# Altium schematic sheet Sheet4.SchDoc
size A3; SheetNumber: 4; SheetTotal: 6
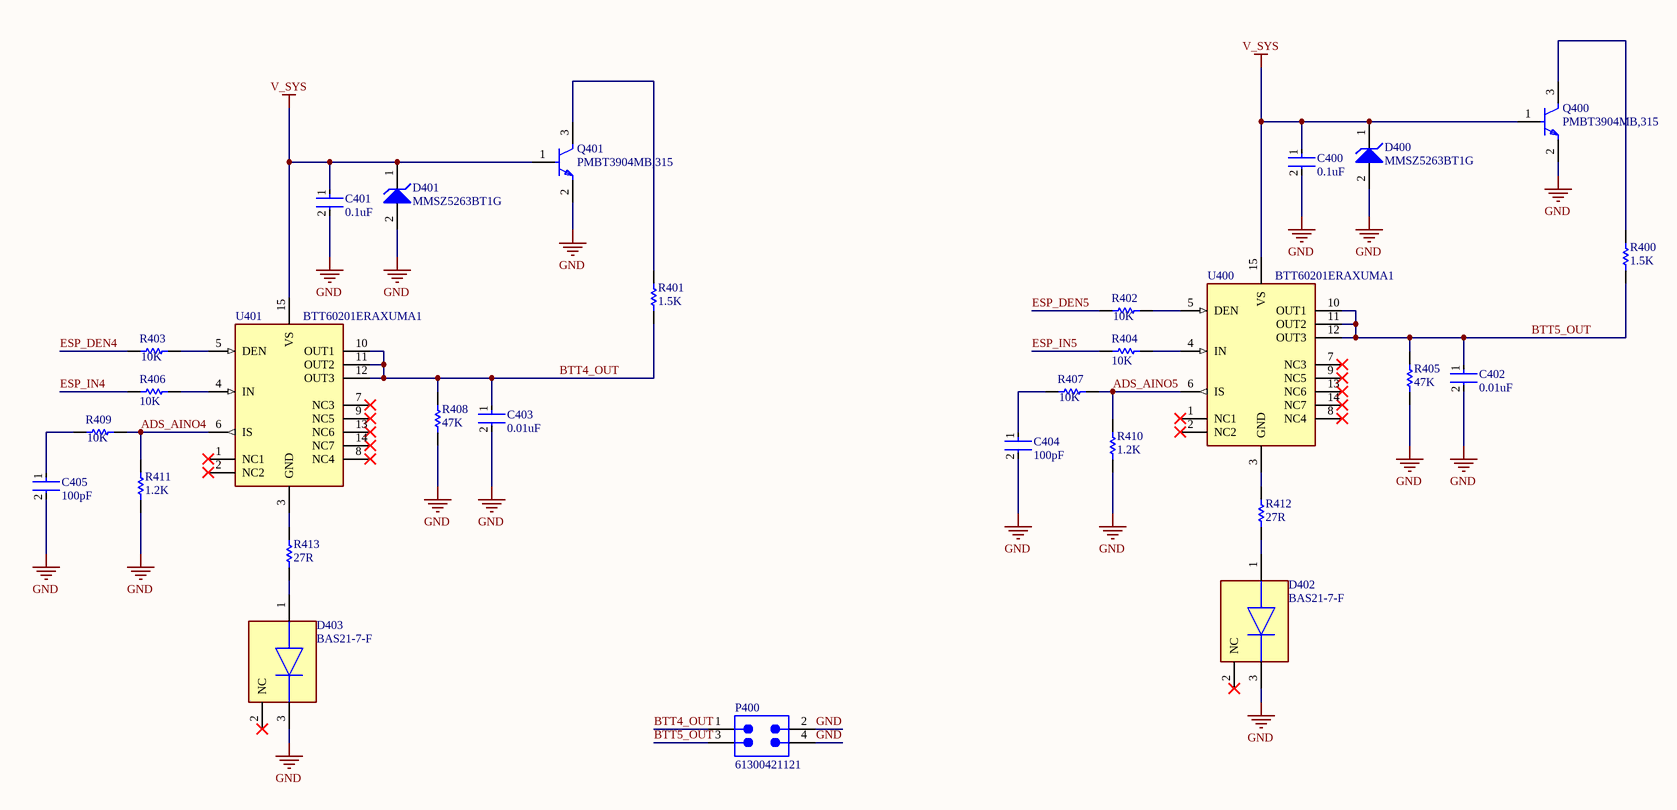
[diagram p0: Sheet4.SchDoc]

## Parts
C400  0.1uF  [FP-GRM155-0_05-IPC_B]
C401  0.1uF  [FP-GRM155-0_05-IPC_B]
C402  0.01uF  [FP-GRM155-0_05-IPC_C]
C403  0.01uF  [FP-GRM155-0_05-IPC_C]
C404  100pF  [FP-C0402-BB-MFG]
C405  100pF  [FP-C0402-BB-MFG]
D400  MMSZ5263BT1G  [ONSC-SOD-123-2-425-04_V]
D401  MMSZ5263BT1G  [ONSC-SOD-123-2-425-04_V]
D402  BAS21-7-F  [FP-SOT23-MFG]
D403  BAS21-7-F  [FP-SOT23-MFG]
P400  61300421121  [61300421121]
Q400  PMBT3904MB,315  [FP-SOT883B-MFG]
Q401  PMBT3904MB,315  [FP-SOT883B-MFG]
R400  1.5K  [RESC1005X40X25ML05T10]
R401  1.5K  [RESC1005X40X25ML05T10]
R402  10K  [RESC1005X40X25LL05T10]
R403  10K  [RESC1005X40X25LL05T10]
R404  10K  [RESC1005X40X25LL05T10]
R405  47K  [RESC1005X40X25ML05T10]
R406  10K  [RESC1005X40X25LL05T10]
R407  10K  [RESC1005X40X25LL05T10]
R408  47K  [RESC1005X40X25ML05T10]
R409  10K  [RESC1005X40X25LL05T10]
R410  1.2K  [RESC1005X40X25ML05T10]
R411  1.2K  [RESC1005X40X25ML05T10]
R412  27R  [RESC1005X40X25LL05T10]
R413  27R  [RESC1005X40X25LL05T10]
U400  BTT60201ERAXUMA1  [BTT60201ERAXUMA1]
U401  BTT60201ERAXUMA1  [BTT60201ERAXUMA1]

## Nets
GND: C400.2 C401.2 C402.2 C403.2 C404.2 C405.2 D400.2(A) D401.2(A) D402.3(C) D403.3(C) P400.2 P400.4 Q400.2(E) Q401.2(E) R405.1 R408.1 R410.1 R411.1
V_SYS: C400.1 C401.1 D400.1(K) D401.1(K) Q400.1(B) Q401.1(B) U400.15(VS) U401.15(VS)
ADS_AINO4: R409.2 R411.2 U401.6(IS)
ADS_AINO5: R407.2 R410.2 U400.6(IS)
BTT4_OUT: C403.1 P400.1 R401.1 R408.2 U401.10(OUT1) U401.11(OUT2) U401.12(OUT3)
BTT5_OUT: C402.1 P400.3 R400.1 R405.2 U400.10(OUT1) U400.11(OUT2) U400.12(OUT3)
ESP_DEN4: R403.1
ESP_DEN5: R402.1
ESP_IN4: R406.1
ESP_IN5: R404.1
NetC404_1: C404.1 R407.1
NetC405_1: C405.1 R409.1
NetD402_1: D402.1(A) R412.1
NetD403_1: D403.1(A) R413.1
NetQ400_3: Q400.3(C) R400.2
NetQ401_3: Q401.3(C) R401.2
NetR402_2: R402.2 U400.5(DEN)
NetR403_2: R403.2 U401.5(DEN)
NetR404_2: R404.2 U400.4(IN)
NetR406_2: R406.2 U401.4(IN)
NetR412_2: R412.2 U400.3(GND)
NetR413_2: R413.2 U401.3(GND)

Not connected (* = marked no-connect by the designer): D402 2(NC)*; D403 2(NC)*; U400 1(NC1)* 2(NC2)* 7(NC3)* 8(NC4)* 9(NC5)* 13(NC6)* 14(NC7)*; U401 1(NC1)* 2(NC2)* 7(NC3)* 8(NC4)* 9(NC5)* 13(NC6)* 14(NC7)*

## Library data of the parts
C400 C401 = CMP-2008-04639-2: Chip Multilayer Ceramic Capacitors for General Purpose, 0402, 0.10uF, X7R, 15%, 10%, 50V; Dissipation Factor: 0.025%; Capacitance: 100nF; Weight: 0.000212oz; Thickness: 0.022inch; Voltage Rating (DC): 50V; Dielectric Material: Ceramic; Termination: SMD/SMT; Case/Package: 0402; Case Code (Imperial): 0402; Mount: Surface Mount; REACH SVHC: No SVHC; Resistor Type: Ceramic; Dielectric: X7R; Max Operating Temperature: 125°C; Voltage: 50V; Lead Free: Lead Free; Package Quantity: 10000; Packaging: Tape and Reel; Length: 1mm; Material: Ceramic; Height: 0.5mm; Depth: 0.5mm; Width: 0.5mm; Min Operating Temperature: -55°C; Tolerance: 10%; Case Code (Metric): 1005; Voltage Rating: 50V
C402 C403 = CMP-2008-04637-5: Chip Multilayer Ceramic Capacitors for General Purpose, 0402, 10000pF, X7R, 15%, 10%, 50V; Voltage: 25V; Capacitance: 10nF; Tolerance: 10%; Mount: Surface Mount; Lead Free: Lead Free; Radiation Hardening: No; Case Code (Imperial): 0402; REACH SVHC: No SVHC; Case/Package: 0402; Dielectric: X7R; Voltage Rating (DC): 50V; Max Operating Temperature: 125°C; Termination: SMD/SMT; Material: Ceramic; Width: 0.02inch; Package Quantity: 1; Voltage Rating: 50V; Thickness: 0.022inch; Packaging: Tape and Reel; Height: 0.5mm; Number of Pins: 2; Case Code (Metric): 1005; Min Operating Temperature: -55°C; Length: 1mm; Depth: 0.5mm
C404 C405 = CMP-2008-03284-2: CAP CER 100PF 50V C0G/NP0 0402; Manufacturer: Kemet; Manufacturer Part Number: C0402C101J5GACTU; Tolerance: 0.05; Temperature Characteristic: C0G; Temperature Coefficient: 15%; Material: Ceramic; Digikey Description: CAP CER 100PF 50V C0G/NP0 0402; Lead Free: Yes; Capacitance: 100 pF; Device Class L3: Ceramic Capacitors; Mouser Description: Multilayer Ceramic Capacitors MLCC - SMD/SMT 50volts 100pF C0G 5%; Octopart: https://octopart.com/c0402c101j5gactu-kemet-132471; Temperature Range Low: -55°C; Value: 100 pF; Automotive: No; Height: 0.55mm; Category: Cap; ComponentLink2URL: https://content.kemet.com/datasheets/KEM_C1002_X7R_SMD.pdf; RoHS: TRUE; Ipc Land Pattern Name: CAPC10050X50; Temperature Range High: +125°C; Device Class L2: Capacitors; Package: C0402-BB; ComponentLink2Description: Datasheet; Temperature: -55°C to +125°C; Voltage Rating: 50 V; Device Class L1: Passive Components
D400 D401 = CMP-1060-00377-1: Zener Voltage Regulator, 500 mW, 2-Pin SOD-123, Pb-Free, Tape and Reel; Manufacturer: On Semiconductor; VZ Typ (V): 56; P Max (W): 0.5; DatasheetVersion: Rev. 12; PackageReference: SOD-123-2-425-04; Mounting Technology: Surface Mount; ComponentLink3URL: http://www.onsemi.com/pub_link/Collateral/425-04.PDF; ComponentLink1Description: Manufacturer URL; ComponentLink3Description: Package Specification; PartNumber: MMSZ5263BT1G; PackageDescription: 2-Pin SOD, Body 1.6 x 2.69 mm; Packing: Tape and Reel; ComponentLink1URL: http://www.onsemi.com/; RoHS: Pb-Free; ComponentLink2Description: Datasheet; ComponentLink2URL: http://www.onsemi.com/pub_link/Collateral/MMSZ5221BT1-D.PDF; PackageVersion: Rev. G, 10/2009
D402 D403 = CMP-12791-000036-1: DIODE GEN PURP 200V 200MA SOT23; Manufacturer: Diodes Inc.; Max Repetitive Reverse Voltage: 250V; Forward Current: 400mA; Max Surge Forward Current: 0.5A; Standoff Height: 0.013mm; Capacitance: 5pF; Max Junction Temp: +150°C; Peak Reverse Current: 0.1uA; Value: 5pF; Device Class L1: Discrete Semiconductors; Category: Diode; Mouser Description: Diodes - General Purpose, Power, Switching 200V 350mW; Digikey Description: DIODE GEN PURP 200V 200MA SOT23; Manufacturer Part Number: BAS21-7-F; Device Class L2: Diodes; RoHS: TRUE; Device Class L3: Rectifier Diodes; Lead Free: Yes; Temperature Range High: +150°C; Ipc Land Pattern Name: SOT92P240X102-3; ComponentLink2Description: Datasheet; Octopart: https://octopart.com/bas21-7-f-diodes+inc.-325943; Reverse Voltage: 200V; Height: 1.1mm; Automotive: No; ComponentLink2URL: https://www.diodes.com/assets/Datasheets/Ds12004.pdf; Temperature: -65°C to +150°C; Temperature Range Low: -65°C; Footprint Url: https://www.diodes.com/assets/Package-Files/SOT23.pdf; Package: SOT23
P400 = CMP-1502-01066-5: THT Vertical Pin Header WR-PHD, Pitch 2.54 mm, Dual Row, 4 pins; Row Spacing: 2.54mm; Gender: Male; Number of Contacts: 4; Contact Resistance: 20mΩ; Connector Type: Male Pin; Voltage Rating: 250V; Current Rating: 3A; Height: 8.89mm; Termination: Solder; RoHS: Compliant; Color: Black; Max Operating Temperature: 105°C; Min Operating Temperature: -40°C; Contact Material: Gold; Pitch: 2.54mm; Lead Pitch: 2.54mm; Contact Plating: Gold; Number of Pins: 4; Mount: Through Hole; Number of Rows: 2; Number of Positions: 4; Orientation: Vertical; Operating Supply Voltage: 250V; Lead Free: Lead Free; Contact Mating Length: 5.9944mm; Packaging: Bulk
Q400 Q401 = CMP-14406-000022-1: TRANS NPN 40V 0.2A 3DFN
R400 R401 = CMP-2002-07464-1: Manufacturer: Yageo / Phycomp; Part Number: RC0402FR-071K5L
R402-R404 R406 R407 R409 = CMP-2002-07353-1: Part Number: RC0402FR-0710KL; Manufacturer: Yageo / Phycomp
R405 R408 = CMP-2002-07701-1: Part Number: RC0402FR-0747KL; Manufacturer: Yageo / Phycomp
R410 R411 = CMP-2002-07456-1: Part Number: RC0402FR-071K2L; Manufacturer: Yageo / Phycomp
R412 R413 = CMP-2002-07055-1: Part Number: RC0402FR-0727RL; Manufacturer: Yageo / Phycomp
U400 U401 = BTT60201ERAXUMA1: Power Switch ICs – Power Distribution; INFINEON; BTT60201ERAXUMA1; 1; 7 A; Max Junction Temperature (Tj): 150°C; Max Output current: 7A; Max Power Dissipation: 1.6W; Max Supply Current: 9mA; Max Supply Voltage: 48V; Min Supply Voltage: 5V; Number of Circuits: 1; Operating Supply Voltage: 8V; Supplier: Farnell; Supplier Part Number: BTT60201ERAXUMA1; Manufacturer: Infineon; Manufacturer Part Number: BTT60201ERAXUMA1; RoHS: Compliant; Category: Power Switch ICs - Power Distribution; Stock: 7297; Pricing: 5=4,52, 50=2,78, 100=2,42, 500=2, 1500=1,67 (EUR); Height: 1.15mm; Height - Seated (Max): 1.15mm; Length: 8.65mm; Lifecycle Status: Production; Max Operating Temperature: 150°C; Min Operating Temperature: -40°C; Number of Outputs: 1; Number of Terminals: 14; Output Current: 7A; Ratings: AEC-Q100; REACH SVHC: Yes; Schedule B: 8542390000, 8542390000|8542390000|8542390000|8542390000|8542390000; Terminal Pitch: 1.27mm; Width: 3.9mm; ComponentLink1URL: https://datasheet.octopart.com:443/BTT60201ERAXUMA1-Infineon-datasheet-180055284.pdf?src-supplier=IHS; ComponentLink1Description: https://datasheet.octopart.com:443/BTT60201ERAXUMA1-Infineon-datasheet-180055284.pdf?src-supplier=IHS; ComponentLink2URL: http://sigma.octopart.com:80/conflict_mineral_statement/Infineon-company-51.pdf?src-supplier=Compliance+Statements; ComponentLink2Description: http://sigma.octopart.com:80/conflict_mineral_statement/Infineon-company-51.pdf?src-supplier=Compliance+Statements